# EAGLE schematic zik-base-with-gpu-001 (EAGLE 6.4)
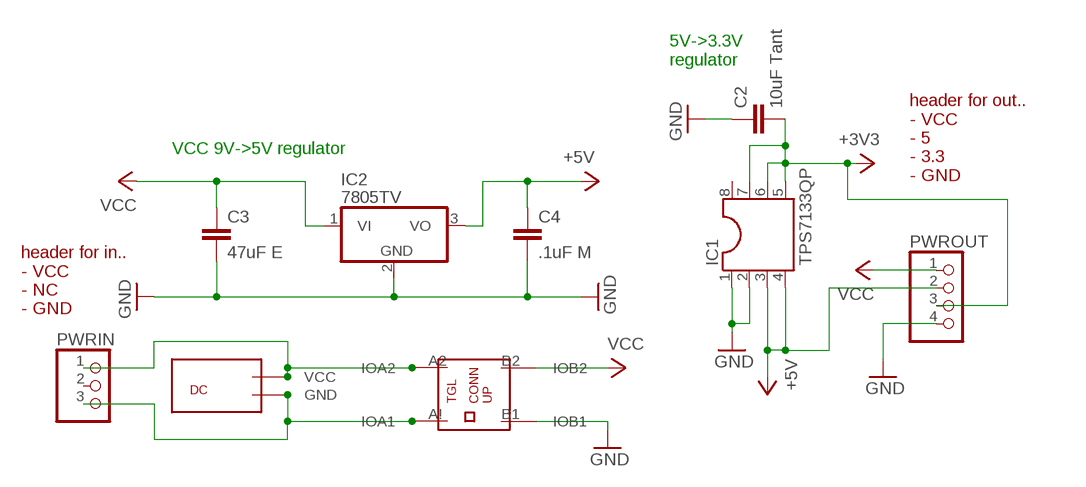
[diagram p0: schematic, sheet 1]

## Parts
C2  10uF Tant  C-EU025-025X050  [C025-025X050]
C3  47uF E  C-EU025-025X050  [C025-025X050]
C4  .1uF M  C-EU025-025X050  [C025-025X050]
IC1  TPS7133QP  DIL8  [DIL08]
IC2  7805TV  [TO220V]
PWRIN  PINHD-1X3  [1X03]
PWROUT  PINHD-1X4  [1X04]
U$1  DCJACKZIK  [DCJACKZIK]
U$2  TOGGLE-CYAN-L-ZIK  [TOGGLE-CYAN-LG-ZIK]

## Nets
+3V3: C2.2 IC1.5 IC1.6 IC1.7 PWROUT.3
+5V: C4.1 IC1.3 IC1.4 IC2.3(VO) PWROUT.2
GND: C2.1 C3.2 C4.2 IC1.1 IC1.2 IC2.2(GND) PWROUT.4
N$1: PWRIN.1
N$2: PWRIN.3
VCC: C3.1 IC2.1(VI) PWROUT.1
Unconnected: IC1.8 PWRIN.2 U$2.A2(IOA2) U$2.A!(IOA1) U$2.B1(IOB1) U$2.B2(IOB2)

## Notes on the sheet
- 5V->3.3V
  regulator
- VCC 9V->5V regulator
- header for out..
  - VCC
  - 5
  - 3.3
  - GND
- header for in..
  - VCC
  - NC
  - GND

## Power pins joined to a net without a drawn wire
GND: U$1.JACKET(GND)
VCC: U$1.CPIN(VCC)

## Library data of the parts
C2-C4 = rcl:C-EU: CAPACITOR, European symbol
IC1 = ic-package:DIL8: Dual In Line / Socket
IC2 = linear:78*: Positive VOLTAGE REGULATOR Source: http://cache.national.com/ds/LM/LM78L05.pdf http://www.fairchildsemi.com/ds/LM/LM7805.pdf
PWRIN = pinhead:PINHD-1X3: PIN HEADER
PWROUT = pinhead:PINHD-1X4: PIN HEADER
U$1 = skeezix:DCJACKZIK
U$2 = skeezix:TOGGLE-CYAN-L-ZIK